# Altium schematic sheet supply.SchDoc
size A; SheetNumber: 4; SheetTotal: 4
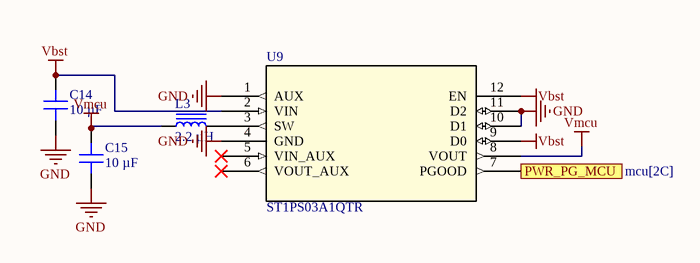
[diagram p0: supply.SchDoc]

## Parts
C14  10 µF  [CAP 0402_1005]
C15  10 µF  [CAP 0402_1005]
L3  2.2 µH  [TDK VLS201612CX]
U9  ST1PS03A1QTR  [TQFN12_2X1P7_STM]

## Ports
PWR_PG_MCU (out, see mcu[2C])

## Nets
GND: C14.2 C15.2 U9.1(AUX) U9.4(GND) U9.10(D1) U9.11(D2)
Vbst: C14.1 U9.2(VIN) U9.9(D0) U9.12(EN)
Vmcu: C15.1 L3.1 U9.8(VOUT)
PWR_PG_MCU: U9.7(PGOOD) ; port PWR_PG_MCU
NetL3_2: L3.2 U9.3(SW)

Not connected (* = marked no-connect by the designer): U9 5(VIN_AUX)* 6(VOUT_AUX)*

## Library data of the parts
C14 C15 = C0402C104K7PAC7867: CAP CER 0.1UF 4V X5R 0402; manufacturer: KEMET; Capacitance: 0.1 µF; Tolerance: ±10%; Part Number: C0402C104K7PAC7867; Value: 10 µF; Applications: Bypass, Decoupling; componentlink1description: Datasheet; componentlink1url: https://api.kemet.com/component-edge/download/datasheet/C0402C104K7PAC7867.pdf; componentlink2description: DigiKey Link; componentlink2url: https://www.digikey.com/en/products/detail/kemet/C0402C104K7PAC7867/7381987; Device Package: 0402 (1005 Metric); lastupdated: 1/9/2022 12:30:40 pm; Lifecycle Status: Active; Minimum Order: 1; Mounting Type: Surface Mount, MLCC; Operating Temperature: -55°C ~ 85°C; Package / Case: 0402 (1005 Metric); packaging: TapeAndReel; partid: 5603; Part Status: Active; price: 0.01; series: SMD Comm X5R; Size / Dimension: 0.039" L x 0.020" W (1.00mm x 0.50mm); Supplier 1: DigiKey; Supplier Part Number 1: 399-14871-1-ND; Temperature Coefficient: X5R; Thickness (Max): 0.022" (0.55mm); Voltage - Rated: 4V
L3 = VLS201612CX-6R8M-1: FIXED IND 6.8UH 930MA 368MOHM SM; Manufacturer: TDK Corporation; Current - Saturation: 730mA; DC Resistance (DCR): 368mOhm Max; Inductance: 6.8 µH; Inductance Frequency - Test: 1 MHz; Material - Core: Ferrite; Shielding: Shielded; Tolerance: ±20%; Type: Drum Core, Wirewound; Part Number: VLS201612CX-6R8M-1; ComponentLink1Description: Datasheet; ComponentLink1URL: https://product.tdk.com/info/en/catalog/datasheets/inductor_commercial_power_vls201612cx-1_en.pdf?ref_disty=digikey; ComponentLink2Description: DigiKey Link; ComponentLink2URL: https://www.digikey.com/en/products/detail/tdk-corporation/VLS201612CX-6R8M-1/5169771; Current Rating (Amps): 930 mA; Device Package: Nonstandard; Height - Seated (Max): 0.047" (1.20mm); LastUpdated: 11/9/2022 10:31:03 am; Lifecycle Status: Active; Minimum Order: 1; Mounting Type: Surface Mount; Operating Temperature: -40°C ~ 105°C; Package / Case: Nonstandard; Packaging: TapeAndReel; PartId: 207; Part Status: Active; Price: 0.13; Series: VLS-CX-1; Size / Dimension: 0.079" L x 0.063" W (2.00mm x 1.60mm); Supplier 1: DigiKey; Supplier Part Number 1: 445-172966-1-ND; Supplier Device Package: 2016; Value: 2.2 µH
U9 = ST1PS03A1QTR: No Description Available; Mfr_Name: STMicroelectronics; RefDes: RefDes; Type: Type